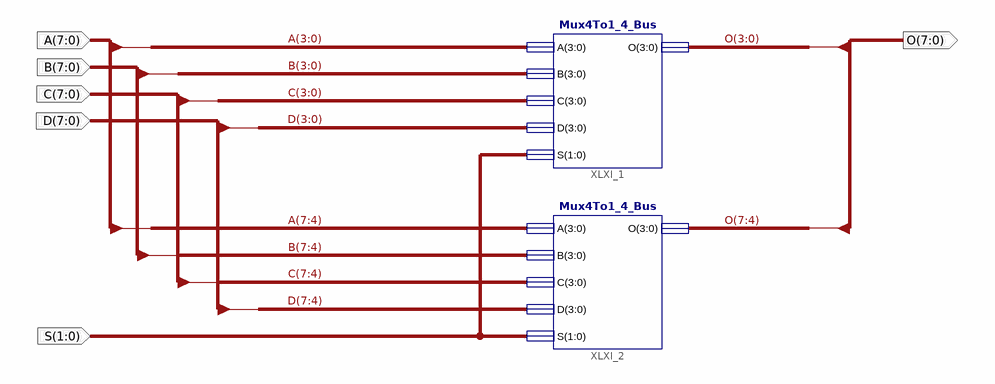
[diagram p0: schematic sheet 1]
// Xilinx ISE schematic Mux4To1_8_Bus.sch (spartan6) as structural Verilog: 2 symbols, 6 ports
module Mux4To1_8_Bus (
  input  [1:0] S,
  input  [7:0] A,
  input  [7:0] B,
  input  [7:0] C,
  input  [7:0] D,
  output [7:0] O
);

  Mux4To1_4_Bus XLXI_2 (.O(O[7:4]), .A(A[7:4]), .B(B[7:4]), .C(C[7:4]), .D(D[7:4]), .S(S));
  Mux4To1_4_Bus XLXI_1 (.O(O[3:0]), .A(A[3:0]), .B(B[3:0]), .C(C[3:0]), .D(D[3:0]), .S(S));
endmodule
